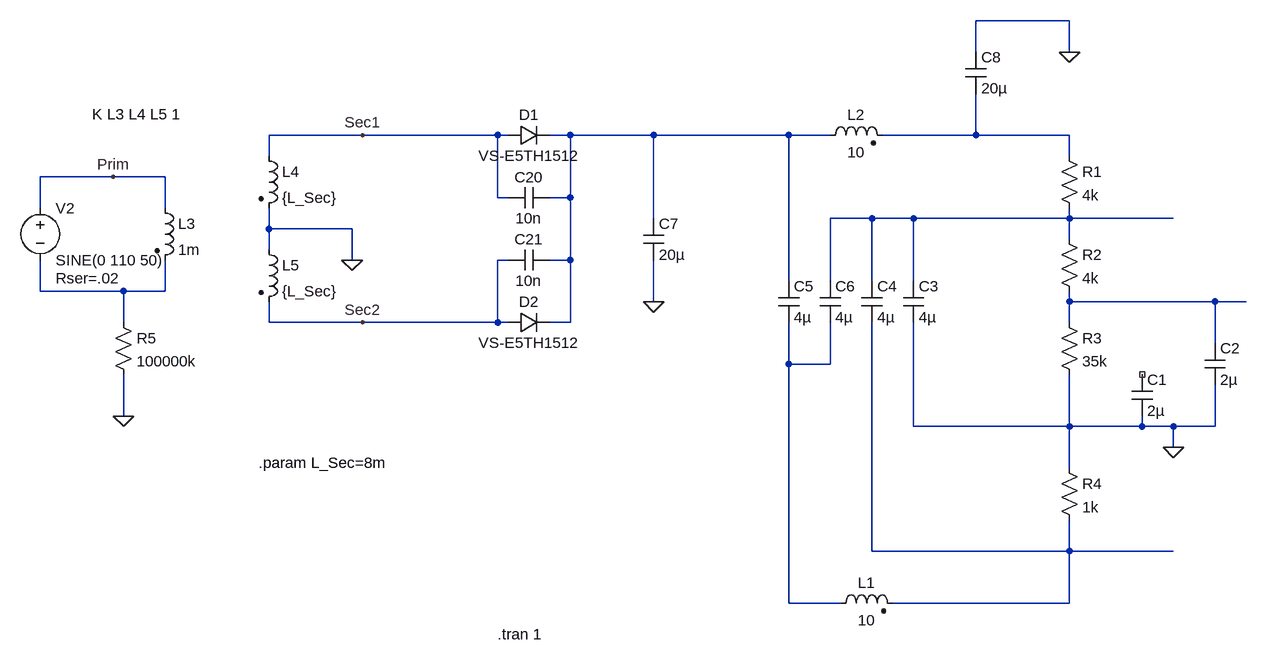
[diagram p0: schematic Ferrix-BL4-5.asc]
Ferrix-BL4-5.asc, the LTspice schematic file:
Version 4
SHEET 1 1572 852
WIRE 1296 -176 1152 -176
WIRE 1152 -128 1152 -176
WIRE 1296 -128 1296 -176
WIRE 208 0 64 0
WIRE 416 0 208 0
WIRE 432 0 416 0
WIRE 528 0 496 0
WIRE 656 0 528 0
WIRE 864 0 656 0
WIRE 928 0 864 0
WIRE 1152 0 1152 -64
WIRE 1152 0 1008 0
WIRE 1296 0 1152 0
WIRE 64 32 64 0
WIRE 1296 32 1296 0
WIRE -176 64 -288 64
WIRE -96 64 -176 64
WIRE 416 96 416 0
WIRE 432 96 416 96
WIRE 528 96 528 0
WIRE 528 96 496 96
WIRE -288 112 -288 64
WIRE -96 112 -96 64
WIRE 656 128 656 0
WIRE 992 128 928 128
WIRE 1056 128 992 128
WIRE 1296 128 1296 112
WIRE 1296 128 1056 128
WIRE 1456 128 1296 128
WIRE 64 144 64 112
WIRE 192 144 64 144
WIRE 1296 160 1296 128
WIRE 64 176 64 144
WIRE 192 192 192 144
WIRE 432 192 416 192
WIRE 528 192 528 96
WIRE 528 192 496 192
WIRE 864 224 864 0
WIRE 928 224 928 128
WIRE 992 224 992 128
WIRE 1056 224 1056 128
WIRE -288 240 -288 192
WIRE -160 240 -288 240
WIRE -96 240 -96 192
WIRE -96 240 -160 240
WIRE 656 256 656 192
WIRE 1296 256 1296 240
WIRE 1520 256 1296 256
WIRE 1568 256 1520 256
WIRE -160 288 -160 240
WIRE 64 288 64 256
WIRE 208 288 64 288
WIRE 416 288 416 192
WIRE 416 288 208 288
WIRE 432 288 416 288
WIRE 528 288 528 192
WIRE 528 288 496 288
WIRE 1296 288 1296 256
WIRE 1520 320 1520 256
WIRE 864 352 864 288
WIRE 928 352 928 288
WIRE 928 352 864 352
WIRE -160 432 -160 368
WIRE 1056 448 1056 288
WIRE 1296 448 1296 368
WIRE 1296 448 1056 448
WIRE 1408 448 1408 432
WIRE 1408 448 1296 448
WIRE 1456 448 1408 448
WIRE 1520 448 1520 384
WIRE 1520 448 1456 448
WIRE 1456 480 1456 448
WIRE 1296 512 1296 448
WIRE 992 640 992 288
WIRE 1296 640 1296 592
WIRE 1296 640 992 640
WIRE 1456 640 1296 640
WIRE 864 720 864 352
WIRE 944 720 864 720
WIRE 1296 720 1296 640
WIRE 1296 720 1024 720
FLAG 1456 480 0
FLAG -160 432 0
FLAG 192 192 0
FLAG -176 64 Prim
FLAG 208 0 Sec1
FLAG 208 288 Sec2
FLAG 656 256 0
FLAG 1296 -128 0
SYMBOL diode 432 16 R270
WINDOW 0 32 32 VTop 2
WINDOW 3 0 32 VBottom 2
SYMATTR InstName D1
SYMATTR Value VS-E5TH1512
SYMBOL diode 432 304 R270
WINDOW 0 32 32 VTop 2
WINDOW 3 0 32 VBottom 2
SYMATTR InstName D2
SYMATTR Value VS-E5TH1512
SYMBOL ind2 912 16 R270
WINDOW 0 32 56 VTop 2
WINDOW 3 5 56 VBottom 2
SYMATTR InstName L2
SYMATTR Value 10
SYMATTR Type ind
SYMBOL cap 496 80 R90
WINDOW 0 0 32 VBottom 2
WINDOW 3 32 32 VTop 2
SYMATTR InstName C20
SYMATTR Value 10n
SYMBOL cap 496 176 R90
WINDOW 0 0 32 VBottom 2
WINDOW 3 32 32 VTop 2
SYMATTR InstName C21
SYMATTR Value 10n
SYMBOL res 1280 16 R0
SYMATTR InstName R1
SYMATTR Value 4k
SYMBOL res 1280 144 R0
SYMATTR InstName R2
SYMATTR Value 4k
SYMBOL res 1280 272 R0
SYMATTR InstName R3
SYMATTR Value 35k
SYMBOL res 1280 496 R0
SYMATTR InstName R4
SYMATTR Value 1k
SYMBOL cap 848 224 R0
SYMATTR InstName C5
SYMATTR Value 4µ
SYMBOL cap 912 224 R0
SYMATTR InstName C6
SYMATTR Value 4µ
SYMBOL cap 976 224 R0
SYMATTR InstName C4
SYMATTR Value 4µ
SYMBOL cap 1040 224 R0
SYMATTR InstName C3
SYMATTR Value 4µ
SYMBOL cap 1392 368 R0
SYMATTR InstName C1
SYMATTR Value 2µ
SYMBOL cap 1504 320 R0
SYMATTR InstName C2
SYMATTR Value 2µ
SYMBOL ind2 928 736 R270
WINDOW 0 32 56 VTop 2
WINDOW 3 5 56 VBottom 2
SYMATTR InstName L1
SYMATTR Value 10
SYMATTR Type ind
SYMBOL ind2 -112 96 R0
SYMATTR InstName L3
SYMATTR Value 1m
SYMBOL voltage -288 96 R0
WINDOW 123 0 0 Left 0
WINDOW 39 24 124 Left 2
SYMATTR SpiceLine Rser=.02
SYMATTR InstName V2
SYMATTR Value SINE(0 110 50)
SYMBOL res -176 272 R0
SYMATTR InstName R5
SYMATTR Value 100000k
SYMBOL ind2 48 160 R0
SYMATTR InstName L5
SYMATTR Value {L_Sec}
SYMATTR Type ind
SYMBOL ind2 48 16 R0
SYMATTR InstName L4
SYMATTR Value {L_Sec}
SYMATTR Type ind
SYMBOL cap 640 128 R0
SYMATTR InstName C7
SYMATTR Value 20µ
SYMBOL cap 1136 -128 R0
SYMATTR InstName C8
SYMATTR Value 20µ
TEXT 416 768 Left 2 !.tran 1
TEXT -208 -32 Left 2 !K L3 L4 L5 1
TEXT 48 504 Left 2 !.param L_Sec=8m

The netlist it stands for:
* Ferrix-BL4-5.asc
D1 Sec1 N001 VS-E5TH1512
D2 Sec2 N001 VS-E5TH1512
L2 N001 N002 10
C20 N001 Sec1 10n
C21 N001 Sec2 10n
R1 N002 N003 4k
R2 N003 N005 4k
R3 N005 0 35k
R4 0 N007 1k
C5 N001 N006 4µ
C6 N003 N006 4µ
C4 N003 N007 4µ
C3 N003 0 4µ
C1 NC_01 0 2µ
C2 N005 0 2µ
L1 N006 N007 10
L3 Prim N004 1m
V2 Prim N004 SINE(0 110 50) Rser=.02
R5 N004 0 100000k
L5 0 Sec2 {L_Sec}
L4 Sec1 0 {L_Sec}
C7 N001 0 20µ
C8 0 N002 20µ
.model D D
.lib standard.dio
.tran 1
K L3 L4 L5 1
.param L_Sec=8m
.backanno
.end